# Altium schematic sheet Page-9.SchDoc: Booster Ckt
size 203 x 129 mm; CompanyName: InSYS; DrawnBy: NaveenKumar; Revision: 2.0; SheetNumber: 9; SheetTotal: 10; Title2: Gateway
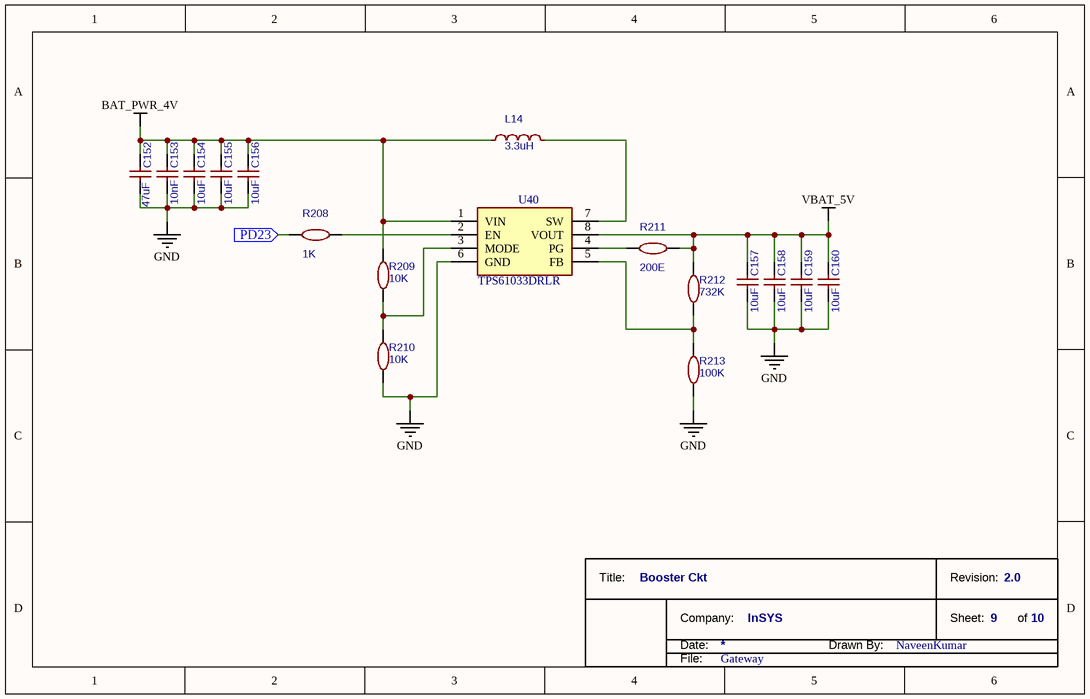
[diagram p0: Page-9.SchDoc]

## Parts
*  TitleBlock_1  (value not drawn)  (graphical)
C152  47uF  [GWAY_Capacitor_0603]
C153  10nF  [GWAY_Capacitor_0603]
C154  10uF  [GWAY_Capacitor_0603]
C155  10uF  [GWAY_Capacitor_0603]
C156  10uF  [GWAY_Capacitor_0603]
C157  10uF  [GWAY_Capacitor_0603]
C158  10uF  [GWAY_Capacitor_0603]
C159  10uF  [GWAY_Capacitor_0603]
C160  10uF  [GWAY_Capacitor_0603]
L14  3.3uH  [GWAY_ETQ-P3M_KVP]
R208  1K  [GWAY_Resistor_0603]
R209  10K  [GWAY_Resistor_0603]
R210  10K  [GWAY_Resistor_0603]
R211  200E  [GWAY_Resistor_0603]
R212  732K  [GWAY_Resistor_0603]
R213  100K  [GWAY_Resistor_0603]
U40  TPS61033DRLR

## Ports
PD23 (in)

## Nets
BAT_PWR_4V: C152.1 C153.1 C154.1 C155.1 C156.1 L14.1 R209.1 U40.1(VIN)
GND: C152.2 C153.2 C154.2 C155.2 C156.2 C157.2 C158.2 C159.2 C160.2 R210.2 R213.2 U40.6(GND)
VBAT_5V: C157.1 C158.1 C159.1 C160.1 R211.1 R212.1 U40.8(VOUT)
PD23: R208.2 ; port PD23
NetL14_2: L14.2 U40.7(SW)
NetR208_1: R208.1 U40.2(EN)
NetR209_2: R209.2 R210.1 U40.3(MODE)
NetR211_2: R211.2 U40.4(PG)
NetR212_2: R212.2 R213.1 U40.5(FB)

## Notes on the sheet
- (in symbol TitleBlock_1) Title:; Revision:; Company:; Sheet:; of; Date:; Drawn By:; File:

## Library data of the parts
* = TitleBlock_1: TitleBlock  No-2; TitleName: *; Company: *; Drawn By: *; File: *
C152-C160 = 1uF: Manufacturer Part: CL10B105KA8NNNC; Manufacturer: SAMSUNG(三星); nameAlias: Capacitance; Supplier: LCSC; Supplier Part: C29936; JLCPCB Part Class: Extended Part; spicePre: C; spiceSymbolName: CL10B105KA8NNNC
L14 = 2.2uH: Manufacturer: TDK; Manufacturer Part: VLS5045EX-2R2N; nameAlias: Value; Contributor: LCSC; Supplier: LCSC; Supplier Part: C434831; JLCPCB Part Class: Extended Part; spicePre: L; spiceSymbolName: VLS5045EX-2R2N
R208-R213 = 10K: Manufacturer: YAGEO; Manufacturer Part: RC0603JR-0710KL; nameAlias: Resistance (Ohms); Supplier: LCSC; Supplier Part: C99198; spicePre: R; spiceSymbolName: RC0603JR-0710KL
U40 = TPS61033DRLR: Power Supply; Manufacturer_Name: Texas Instruments; Datasheet Link: https://www.ti.com/lit/gpn/tps61033; Height: 0.6mm; Manufacturer_Part_Number: TPS61033DRLR; Mouser Part Number: 595-TPS61033DRLR; Mouser Price/Stock: https://www.mouser.co.uk/ProductDetail/Texas-Instruments/TPS61033DRLR?qs=9vOqFld9vZX5q6IURWsMrA%3D%3D